# Altium schematic sheet Activity_Recognition_Board_v1.0_TOP.SchDoc
size A4
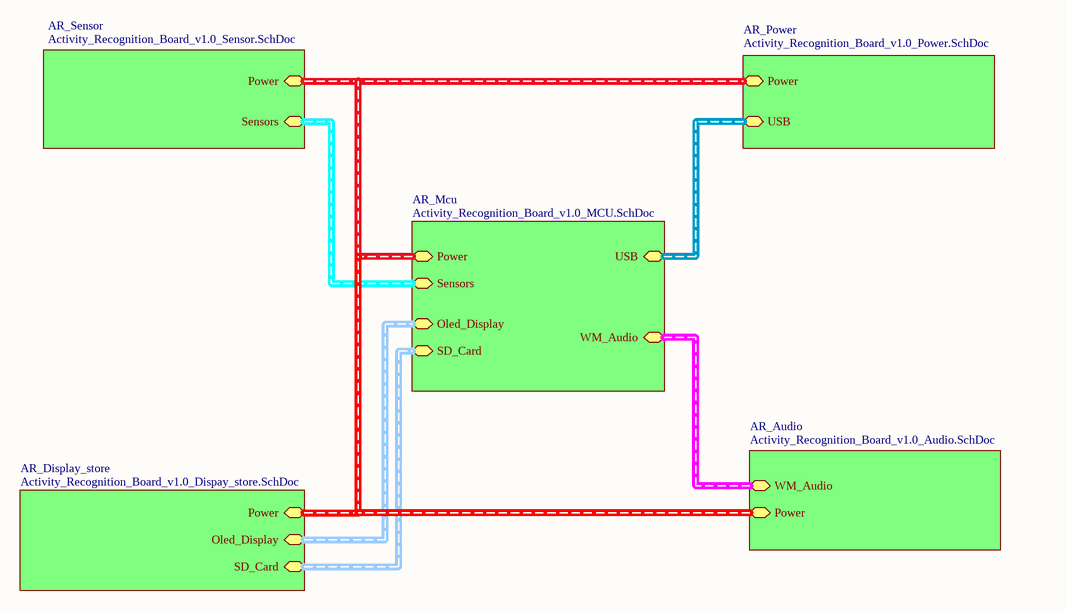
[diagram p0: Activity_Recognition_Board_v1.0_TOP.SchDoc]

## Sub-sheets
AR_Audio = Activity_Recognition_Board_v1.0_Audio.SchDoc: Power (harness Power), WM_Audio (harness WM_Audio)
AR_Display_store = Activity_Recognition_Board_v1.0_Dispay_store.SchDoc: SD_Card (harness SD_Card), Power (harness Power), Oled_Display (harness Oled_Display)
AR_Mcu = Activity_Recognition_Board_v1.0_MCU.SchDoc: SD_Card (harness SD_Card), Power (harness Power), Sensors (harness Sensors), USB (harness USB), Oled_Display (harness Oled_Display), WM_Audio (harness WM_Audio)
AR_Power = Activity_Recognition_Board_v1.0_Power.SchDoc: Power (harness Power), USB (harness USB)
AR_Sensor = Activity_Recognition_Board_v1.0_Sensor.SchDoc: Sensors (harness Sensors), Power (harness Power)

## Buses and harness runs
harness sheet AR_Audio/Power = sheet AR_Display_store/Power = sheet AR_Mcu/Power = sheet AR_Power/Power = sheet AR_Sensor/Power
harness sheet AR_Audio/WM_Audio = sheet AR_Mcu/WM_Audio
harness sheet AR_Display_store/Oled_Display = sheet AR_Mcu/Oled_Display
harness sheet AR_Display_store/SD_Card = sheet AR_Mcu/SD_Card
harness sheet AR_Mcu/Sensors = sheet AR_Sensor/Sensors
harness sheet AR_Mcu/USB = sheet AR_Power/USB